# EAGLE schematic spi_cam (EAGLE 7.7.0)
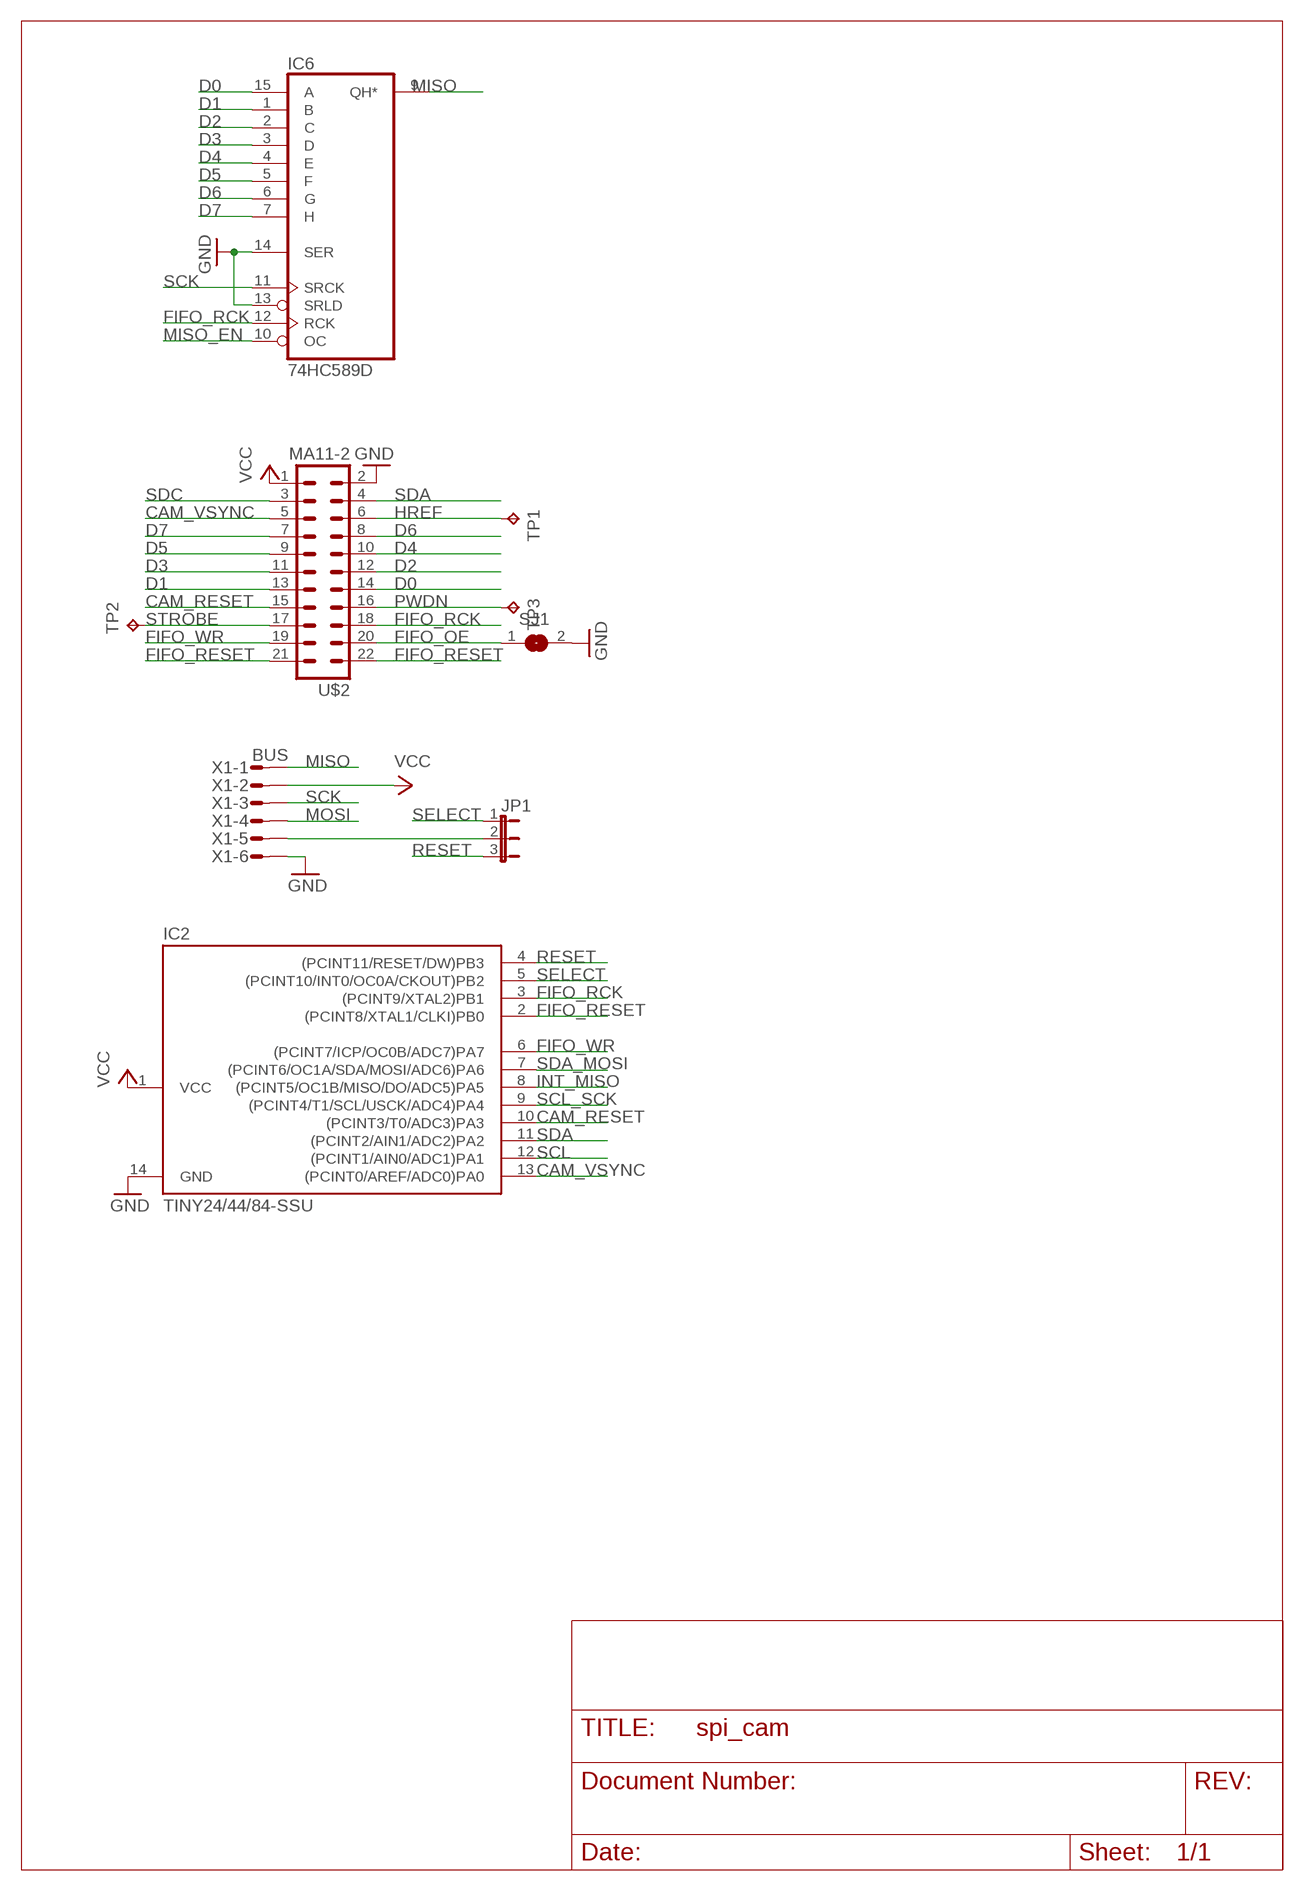
[diagram p0: schematic, sheet 1]

## Parts
IC2  TINY24/44/84-SSU  [SOIC14]
IC6  74HC589D  [SO16]
JP1  JP2E  [JP2]
SJ1  SJ  [SJ]
TP1  TPB1,27  [B1,27]
TP2  TPB1,27  [B1,27]
TP3  TPB1,27  [B1,27]
U$2  MA11-2  [MA11-2]
X1  BUS  MICROMATCH-6  [MICROMATCH-6]

## Nets
CAM_RESET: IC2.10((PCINT3/T0/ADC3)PA3) U$2.15
CAM_VSYNC: IC2.13((PCINT0/AREF/ADC0)PA0) U$2.5
D0: IC6.15(A) U$2.14
D1: IC6.1(B) U$2.13
D2: IC6.2(C) U$2.12
D3: IC6.3(D) U$2.11
D4: IC6.4(E) U$2.10
D5: IC6.5(F) U$2.9
D6: IC6.6(G) U$2.8
D7: IC6.7(H) U$2.7
FIFO_OE: SJ1.1 U$2.20
FIFO_RCK: IC2.3((PCINT9/XTAL2)PB1) IC6.12(RCK) U$2.18
FIFO_RESET: IC2.2((PCINT8/XTAL1/CLKI)PB0) U$2.21 U$2.22
FIFO_WR: IC2.6((PCINT7/ICP/OC0B/ADC7)PA7) U$2.19
GND: IC2.14(GND) IC6.13(SRLD) IC6.14(SER) SJ1.2 U$2.2 X1.6
HREF: TP1.TP U$2.6
INT_MISO: IC2.8((PCINT5/OC1B/MISO/DO/ADC5)PA5)
MISO: IC6.9(QH*) X1.1
MISO_EN: IC6.10(OC)
MOSI: X1.4
N$1: JP1.2 X1.5
PWDN: TP3.TP U$2.16
RESET: IC2.4((PCINT11/RESET/DW)PB3) JP1.3
SCK: IC6.11(SRCK) X1.3
SCL: IC2.12((PCINT1/AIN0/ADC1)PA1)
SCL_SCK: IC2.9((PCINT4/T1/SCL/USCK/ADC4)PA4)
SDA: IC2.11((PCINT2/AIN1/ADC2)PA2) U$2.4
SDA_MOSI: IC2.7((PCINT6/OC1A/SDA/MOSI/ADC6)PA6)
SDC: U$2.3
SELECT: IC2.5((PCINT10/INT0/OC0A/CKOUT)PB2) JP1.1
STROBE: TP2.TP U$2.17
VCC: IC2.1(VCC) U$2.1 X1.2

## Power pins joined to a net without a drawn wire
GND: IC6.8(GND)
VCC: IC6.16(VCC)

## Library data of the parts
IC2 = avr-7:TINY24/44/84
IC6 = 74xx-eu:74*589: 8-bit SHIFT REGISTER, input latch, 3-state
JP1 = jumper:JP2E: JUMPER
SJ1 = jumper:SJ: SMD solder JUMPER
TP1-TP3 = testpad:TP: Test pad
U$2 = con-lstb:MA11-2
X1 = con-amp-micromatch:MICROMATCH-6: MicroMaTch 6 7-215464-6 / 0-215464-6 Drawing Number C-215464 DDEController.pdf; MPN: 7-215464-6; OC_FARNELL: 3784630; OC_NEWARK: 19R8125